# EAGLE design Light (EAGLE 8.7.0)
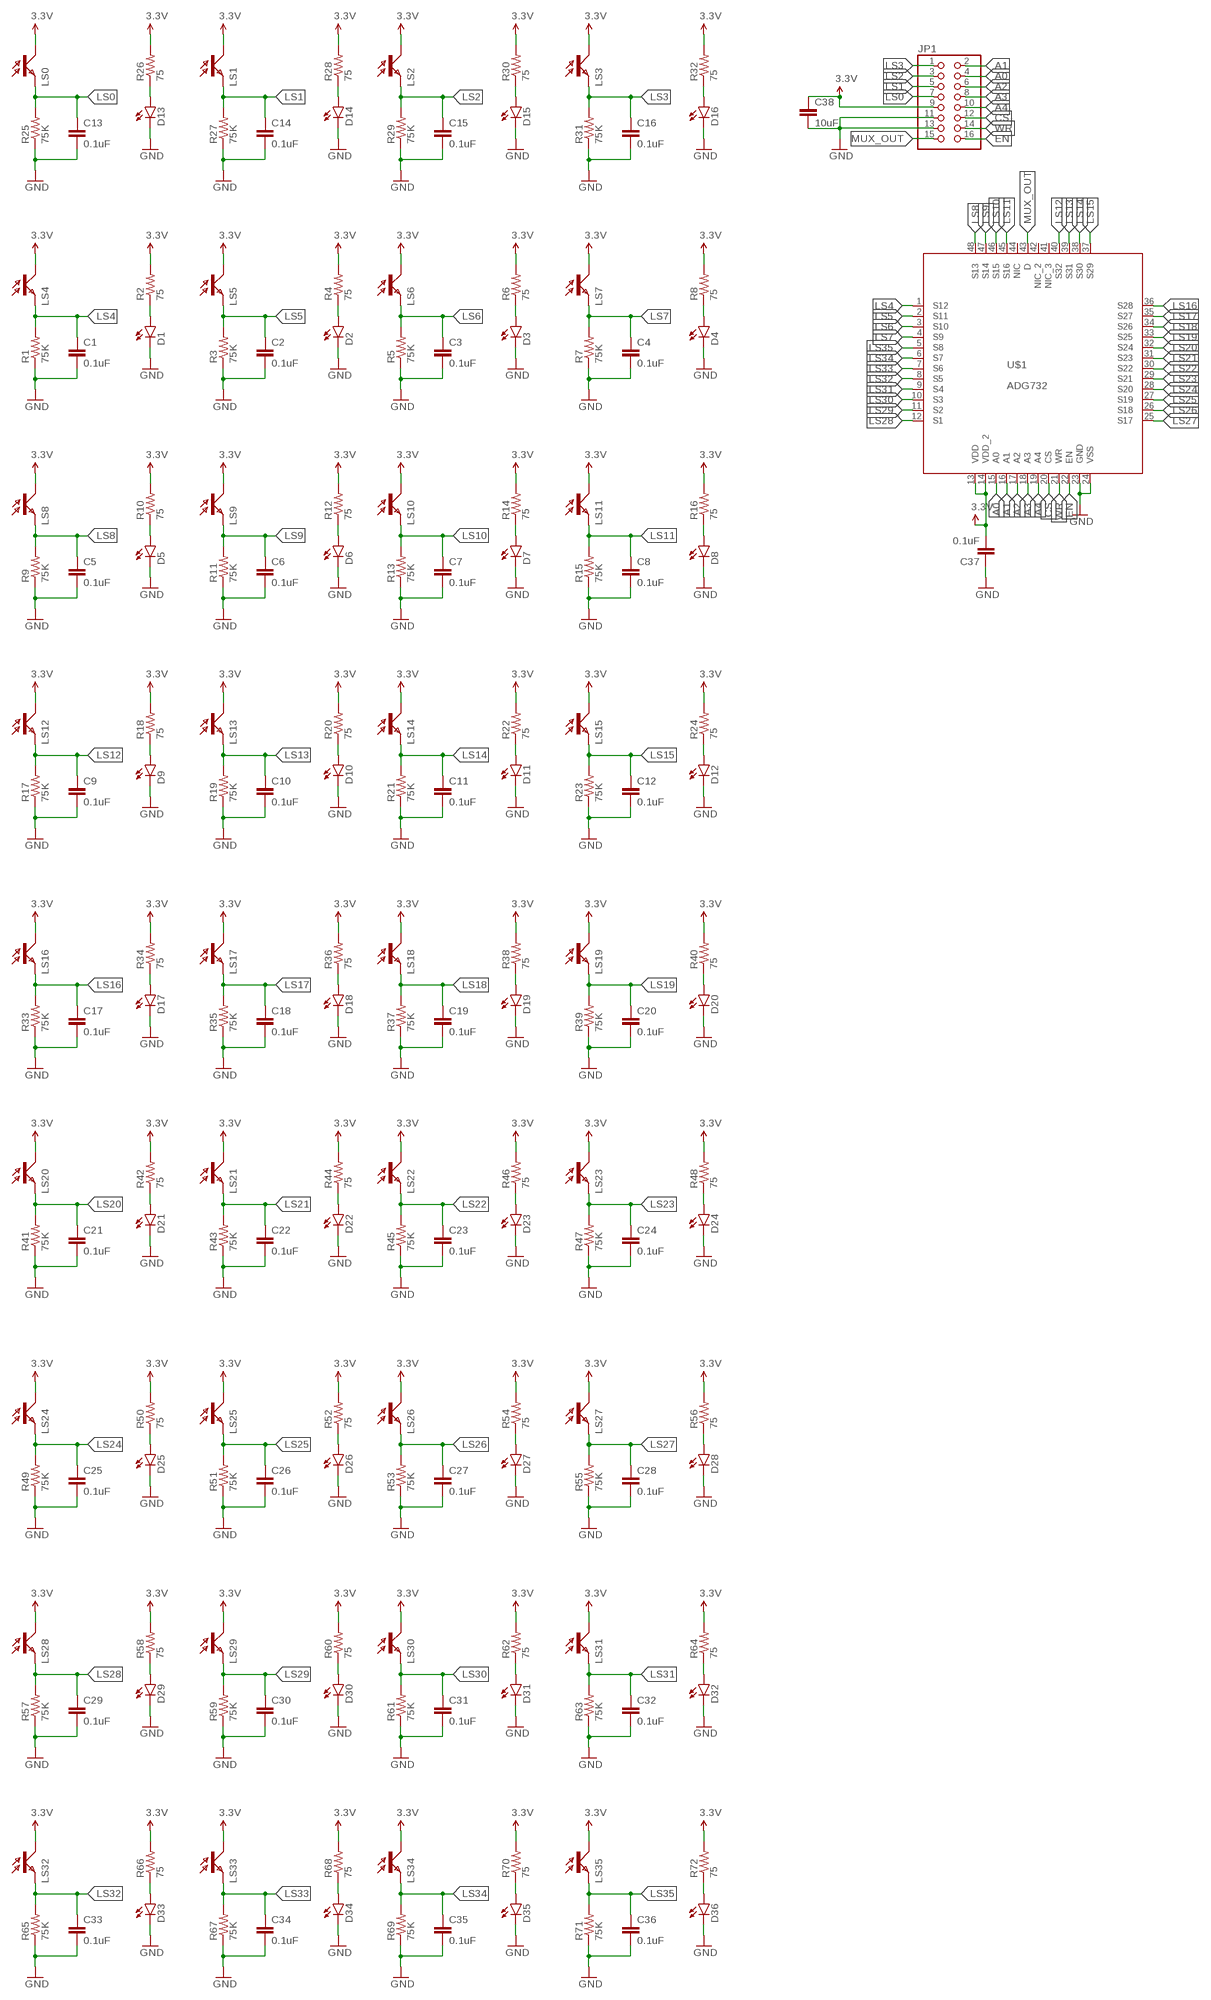
[diagram p0: schematic, sheet 1]

## Parts
C1  0.1uF  CAP0603-CAP  [0603-CAP]
C2  0.1uF  CAP0603-CAP  [0603-CAP]
C3  0.1uF  CAP0603-CAP  [0603-CAP]
C4  0.1uF  CAP0603-CAP  [0603-CAP]
C5  0.1uF  CAP0603-CAP  [0603-CAP]
C6  0.1uF  CAP0603-CAP  [0603-CAP]
C7  0.1uF  CAP0603-CAP  [0603-CAP]
C8  0.1uF  CAP0603-CAP  [0603-CAP]
C9  0.1uF  CAP0603-CAP  [0603-CAP]
C10  0.1uF  CAP0603-CAP  [0603-CAP]
C11  0.1uF  CAP0603-CAP  [0603-CAP]
C12  0.1uF  CAP0603-CAP  [0603-CAP]
C13  0.1uF  CAP0603-CAP  [0603-CAP]
C14  0.1uF  CAP0603-CAP  [0603-CAP]
C15  0.1uF  CAP0603-CAP  [0603-CAP]
C16  0.1uF  CAP0603-CAP  [0603-CAP]
C17  0.1uF  CAP0603-CAP  [0603-CAP]
C18  0.1uF  CAP0603-CAP  [0603-CAP]
C19  0.1uF  CAP0603-CAP  [0603-CAP]
C20  0.1uF  CAP0603-CAP  [0603-CAP]
C21  0.1uF  CAP0603-CAP  [0603-CAP]
C22  0.1uF  CAP0603-CAP  [0603-CAP]
C23  0.1uF  CAP0603-CAP  [0603-CAP]
C24  0.1uF  CAP0603-CAP  [0603-CAP]
C25  0.1uF  CAP0603-CAP  [0603-CAP]
C26  0.1uF  CAP0603-CAP  [0603-CAP]
C27  0.1uF  CAP0603-CAP  [0603-CAP]
C28  0.1uF  CAP0603-CAP  [0603-CAP]
C29  0.1uF  CAP0603-CAP  [0603-CAP]
C30  0.1uF  CAP0603-CAP  [0603-CAP]
C31  0.1uF  CAP0603-CAP  [0603-CAP]
C32  0.1uF  CAP0603-CAP  [0603-CAP]
C33  0.1uF  CAP0603-CAP  [0603-CAP]
C34  0.1uF  CAP0603-CAP  [0603-CAP]
C35  0.1uF  CAP0603-CAP  [0603-CAP]
C36  0.1uF  CAP0603-CAP  [0603-CAP]
C37  0.1uF  CAP0603-CAP  [0603-CAP]
C38  10uF  CAP0805  [0805]
D1  LED0603  [LED-0603]
D2  LED0603  [LED-0603]
D3  LED0603  [LED-0603]
D4  LED0603  [LED-0603]
D5  LED0603  [LED-0603]
D6  LED0603  [LED-0603]
D7  LED0603  [LED-0603]
D8  LED0603  [LED-0603]
D9  LED0603  [LED-0603]
D10  LED0603  [LED-0603]
D11  LED0603  [LED-0603]
D12  LED0603  [LED-0603]
D13  LED0603  [LED-0603]
D14  LED0603  [LED-0603]
D15  LED0603  [LED-0603]
D16  LED0603  [LED-0603]
D17  LED0603  [LED-0603]
D18  LED0603  [LED-0603]
D19  LED0603  [LED-0603]
D20  LED0603  [LED-0603]
D21  LED0603  [LED-0603]
D22  LED0603  [LED-0603]
D23  LED0603  [LED-0603]
D24  LED0603  [LED-0603]
D25  LED0603  [LED-0603]
D26  LED0603  [LED-0603]
D27  LED0603  [LED-0603]
D28  LED0603  [LED-0603]
D29  LED0603  [LED-0603]
D30  LED0603  [LED-0603]
D31  LED0603  [LED-0603]
D32  LED0603  [LED-0603]
D33  LED0603  [LED-0603]
D34  LED0603  [LED-0603]
D35  LED0603  [LED-0603]
D36  LED0603  [LED-0603]
JP1  PINHD-2X8SMT  [2X08_SMT]
LS0  ALS  [SMD]
LS1  ALS  [SMD]
LS2  ALS  [SMD]
LS3  ALS  [SMD]
LS4  ALS  [SMD]
LS5  ALS  [SMD]
LS6  ALS  [SMD]
LS7  ALS  [SMD]
LS8  ALS  [SMD]
LS9  ALS  [SMD]
LS10  ALS  [SMD]
LS11  ALS  [SMD]
LS12  ALS  [SMD]
LS13  ALS  [SMD]
LS14  ALS  [SMD]
LS15  ALS  [SMD]
LS16  ALS  [SMD]
LS17  ALS  [SMD]
LS18  ALS  [SMD]
LS19  ALS  [SMD]
LS20  ALS  [SMD]
LS21  ALS  [SMD]
LS22  ALS  [SMD]
LS23  ALS  [SMD]
LS24  ALS  [SMD]
LS25  ALS  [SMD]
LS26  ALS  [SMD]
LS27  ALS  [SMD]
LS28  ALS  [SMD]
LS29  ALS  [SMD]
LS30  ALS  [SMD]
LS31  ALS  [SMD]
LS32  ALS  [SMD]
LS33  ALS  [SMD]
LS34  ALS  [SMD]
LS35  ALS  [SMD]
R1  75K  RESISTOR0603  [0603-RES]
R2  75  RESISTOR0603  [0603-RES]
R3  75K  RESISTOR0603  [0603-RES]
R4  75  RESISTOR0603  [0603-RES]
R5  75K  RESISTOR0603  [0603-RES]
R6  75  RESISTOR0603  [0603-RES]
R7  75K  RESISTOR0603  [0603-RES]
R8  75  RESISTOR0603  [0603-RES]
R9  75K  RESISTOR0603  [0603-RES]
R10  75  RESISTOR0603  [0603-RES]
R11  75K  RESISTOR0603  [0603-RES]
R12  75  RESISTOR0603  [0603-RES]
R13  75K  RESISTOR0603  [0603-RES]
R14  75  RESISTOR0603  [0603-RES]
R15  75K  RESISTOR0603  [0603-RES]
R16  75  RESISTOR0603  [0603-RES]
R17  75K  RESISTOR0603  [0603-RES]
R18  75  RESISTOR0603  [0603-RES]
R19  75K  RESISTOR0603  [0603-RES]
R20  75  RESISTOR0603  [0603-RES]
R21  75K  RESISTOR0603  [0603-RES]
R22  75  RESISTOR0603  [0603-RES]
R23  75K  RESISTOR0603  [0603-RES]
R24  75  RESISTOR0603  [0603-RES]
R25  75K  RESISTOR0603  [0603-RES]
R26  75  RESISTOR0603  [0603-RES]
R27  75K  RESISTOR0603  [0603-RES]
R28  75  RESISTOR0603  [0603-RES]
R29  75K  RESISTOR0603  [0603-RES]
R30  75  RESISTOR0603  [0603-RES]
R31  75K  RESISTOR0603  [0603-RES]
R32  75  RESISTOR0603  [0603-RES]
R33  75K  RESISTOR0603  [0603-RES]
R34  75  RESISTOR0603  [0603-RES]
R35  75K  RESISTOR0603  [0603-RES]
R36  75  RESISTOR0603  [0603-RES]
R37  75K  RESISTOR0603  [0603-RES]
R38  75  RESISTOR0603  [0603-RES]
R39  75K  RESISTOR0603  [0603-RES]
R40  75  RESISTOR0603  [0603-RES]
R41  75K  RESISTOR0603  [0603-RES]
R42  75  RESISTOR0603  [0603-RES]
R43  75K  RESISTOR0603  [0603-RES]
R44  75  RESISTOR0603  [0603-RES]
R45  75K  RESISTOR0603  [0603-RES]
R46  75  RESISTOR0603  [0603-RES]
R47  75K  RESISTOR0603  [0603-RES]
R48  75  RESISTOR0603  [0603-RES]
R49  75K  RESISTOR0603  [0603-RES]
R50  75  RESISTOR0603  [0603-RES]
R51  75K  RESISTOR0603  [0603-RES]
R52  75  RESISTOR0603  [0603-RES]
R53  75K  RESISTOR0603  [0603-RES]
R54  75  RESISTOR0603  [0603-RES]
R55  75K  RESISTOR0603  [0603-RES]
R56  75  RESISTOR0603  [0603-RES]
R57  75K  RESISTOR0603  [0603-RES]
R58  75  RESISTOR0603  [0603-RES]
R59  75K  RESISTOR0603  [0603-RES]
R60  75  RESISTOR0603  [0603-RES]
R61  75K  RESISTOR0603  [0603-RES]
R62  75  RESISTOR0603  [0603-RES]
R63  75K  RESISTOR0603  [0603-RES]
R64  75  RESISTOR0603  [0603-RES]
R65  75K  RESISTOR0603  [0603-RES]
R66  75  RESISTOR0603  [0603-RES]
R67  75K  RESISTOR0603  [0603-RES]
R68  75  RESISTOR0603  [0603-RES]
R69  75K  RESISTOR0603  [0603-RES]
R70  75  RESISTOR0603  [0603-RES]
R71  75K  RESISTOR0603  [0603-RES]
R72  75  RESISTOR0603  [0603-RES]
U$1  ADG732  [QFP-7X7-48-NO-EXP]

## Nets
3.3V: C37.2 C38.1 JP1.9 LS0.C LS1.C LS2.C LS3.C LS4.C LS5.C LS6.C LS7.C LS8.C LS9.C LS10.C LS11.C LS12.C LS13.C LS14.C LS15.C LS16.C LS17.C LS18.C LS19.C LS20.C LS21.C LS22.C LS23.C LS24.C LS25.C LS26.C LS27.C LS28.C LS29.C LS30.C LS31.C LS32.C LS33.C LS34.C LS35.C R2.2 R4.2 R6.2 R8.2 R10.2 R12.2 R14.2 R16.2 R18.2 R20.2 R22.2 R24.2 R26.2 R28.2 R30.2 R32.2 R34.2 R36.2 R38.2 R40.2 R42.2 R44.2 R46.2 R48.2 R50.2 R52.2 R54.2 R56.2 R58.2 R60.2 R62.2 R64.2 R66.2 R68.2 R70.2 R72.2 U$1.13(VDD) U$1.14(VDD_2)
A0: JP1.4 U$1.15(A0)
A1: JP1.2 U$1.16(A1)
A2: JP1.6 U$1.17(A2)
A3: JP1.8 U$1.18(A3)
A4: JP1.10 U$1.19(A4)
CS: JP1.12 U$1.20(CS)
EN: JP1.16 U$1.22(EN)
GND: C1.2 C2.2 C3.2 C4.2 C5.2 C6.2 C7.2 C8.2 C9.2 C10.2 C11.2 C12.2 C13.2 C14.2 C15.2 C16.2 C17.2 C18.2 C19.2 C20.2 C21.2 C22.2 C23.2 C24.2 C25.2 C26.2 C27.2 C28.2 C29.2 C30.2 C31.2 C32.2 C33.2 C34.2 C35.2 C36.2 C37.1 C38.2 D1.C D2.C D3.C D4.C D5.C D6.C D7.C D8.C D9.C D10.C D11.C D12.C D13.C D14.C D15.C D16.C D17.C D18.C D19.C D20.C D21.C D22.C D23.C D24.C D25.C D26.C D27.C D28.C D29.C D30.C D31.C D32.C D33.C D34.C D35.C D36.C JP1.11 JP1.13 R1.1 R3.1 R5.1 R7.1 R9.1 R11.1 R13.1 R15.1 R17.1 R19.1 R21.1 R23.1 R25.1 R27.1 R29.1 R31.1 R33.1 R35.1 R37.1 R39.1 R41.1 R43.1 R45.1 R47.1 R49.1 R51.1 R53.1 R55.1 R57.1 R59.1 R61.1 R63.1 R65.1 R67.1 R69.1 R71.1 U$1.23(GND) U$1.24(VSS)
LS0: C13.1 JP1.7 LS0.E R25.2
LS1: C14.1 JP1.5 LS1.E R27.2
LS2: C15.1 JP1.3 LS2.E R29.2
LS3: C16.1 JP1.1 LS3.E R31.2
LS4: C1.1 LS4.E R1.2 U$1.1(S12)
LS5: C2.1 LS5.E R3.2 U$1.2(S11)
LS6: C3.1 LS6.E R5.2 U$1.3(S10)
LS7: C4.1 LS7.E R7.2 U$1.4(S9)
LS8: C5.1 LS8.E R9.2 U$1.48(S13)
LS9: C6.1 LS9.E R11.2 U$1.47(S14)
LS10: C7.1 LS10.E R13.2 U$1.46(S15)
LS11: C8.1 LS11.E R15.2 U$1.45(S16)
LS12: C9.1 LS12.E R17.2 U$1.40(S32)
LS13: C10.1 LS13.E R19.2 U$1.39(S31)
LS14: C11.1 LS14.E R21.2 U$1.38(S30)
LS15: C12.1 LS15.E R23.2 U$1.37(S29)
LS16: C17.1 LS16.E R33.2 U$1.36(S28)
LS17: C18.1 LS17.E R35.2 U$1.35(S27)
LS18: C19.1 LS18.E R37.2 U$1.34(S26)
LS19: C20.1 LS19.E R39.2 U$1.33(S25)
LS20: C21.1 LS20.E R41.2 U$1.32(S24)
LS21: C22.1 LS21.E R43.2 U$1.31(S23)
LS22: C23.1 LS22.E R45.2 U$1.30(S22)
LS23: C24.1 LS23.E R47.2 U$1.29(S21)
LS24: C25.1 LS24.E R49.2 U$1.28(S20)
LS25: C26.1 LS25.E R51.2 U$1.27(S19)
LS26: C27.1 LS26.E R53.2 U$1.26(S18)
LS27: C28.1 LS27.E R55.2 U$1.25(S17)
LS28: C29.1 LS28.E R57.2 U$1.12(S1)
LS29: C30.1 LS29.E R59.2 U$1.11(S2)
LS30: C31.1 LS30.E R61.2 U$1.10(S3)
LS31: C32.1 LS31.E R63.2 U$1.9(S4)
LS32: C33.1 LS32.E R65.2 U$1.8(S5)
LS33: C34.1 LS33.E R67.2 U$1.7(S6)
LS34: C35.1 LS34.E R69.2 U$1.6(S7)
LS35: C36.1 LS35.E R71.2 U$1.5(S8)
MUX_OUT: JP1.15 U$1.43(D)
N$1: D2.A R4.1
N$2: D1.A R2.1
N$3: D3.A R6.1
N$4: D4.A R8.1
N$5: D5.A R10.1
N$6: D6.A R12.1
N$7: D7.A R14.1
N$8: D8.A R16.1
N$9: D9.A R18.1
N$10: D10.A R20.1
N$11: D11.A R22.1
N$12: D12.A R24.1
N$13: D13.A R26.1
N$14: D14.A R28.1
N$15: D15.A R30.1
N$16: D16.A R32.1
N$17: D17.A R34.1
N$18: D18.A R36.1
N$19: D19.A R38.1
N$20: D20.A R40.1
N$21: D21.A R42.1
N$22: D22.A R44.1
N$23: D23.A R46.1
N$24: D24.A R48.1
N$25: D25.A R50.1
N$26: D26.A R52.1
N$27: D27.A R54.1
N$28: D28.A R56.1
N$29: D29.A R58.1
N$30: D30.A R60.1
N$31: D31.A R62.1
N$32: D32.A R64.1
N$33: D33.A R66.1
N$34: D34.A R68.1
N$35: D35.A R70.1
N$36: D36.A R72.1
WR: JP1.14 U$1.21(WR)
Unconnected: U$1.41(NIC_3) U$1.42(NIC_2) U$1.44(NIC)

## Library data of the parts
C1-C38 = SparkFun-Capacitors:CAP: Capacitor Standard 0603 ceramic capacitor, and 0.1" leaded capacitor.
D1-D36 = SparkFun-LED:LED: LEDs Standard schematic elements and footprints for 5mm, 3mm, 1206, and 0603 sized LEDs. 5mm - Spark Fun Electronics SKU : COM-00529 (and others)
JP1 = pinhead+:PINHD-2X8: PIN HEADER
LS0 LS1-LS35 = phototransitor-ALS-PT19-315CL177TR8:ALS
R1-R72 = SparkFun-Resistors:RESISTOR: Resistor Basic schematic elements and footprints for 0603, 1206, and PTH resistors.
U$1 = analog-devices:ADG732

## Board
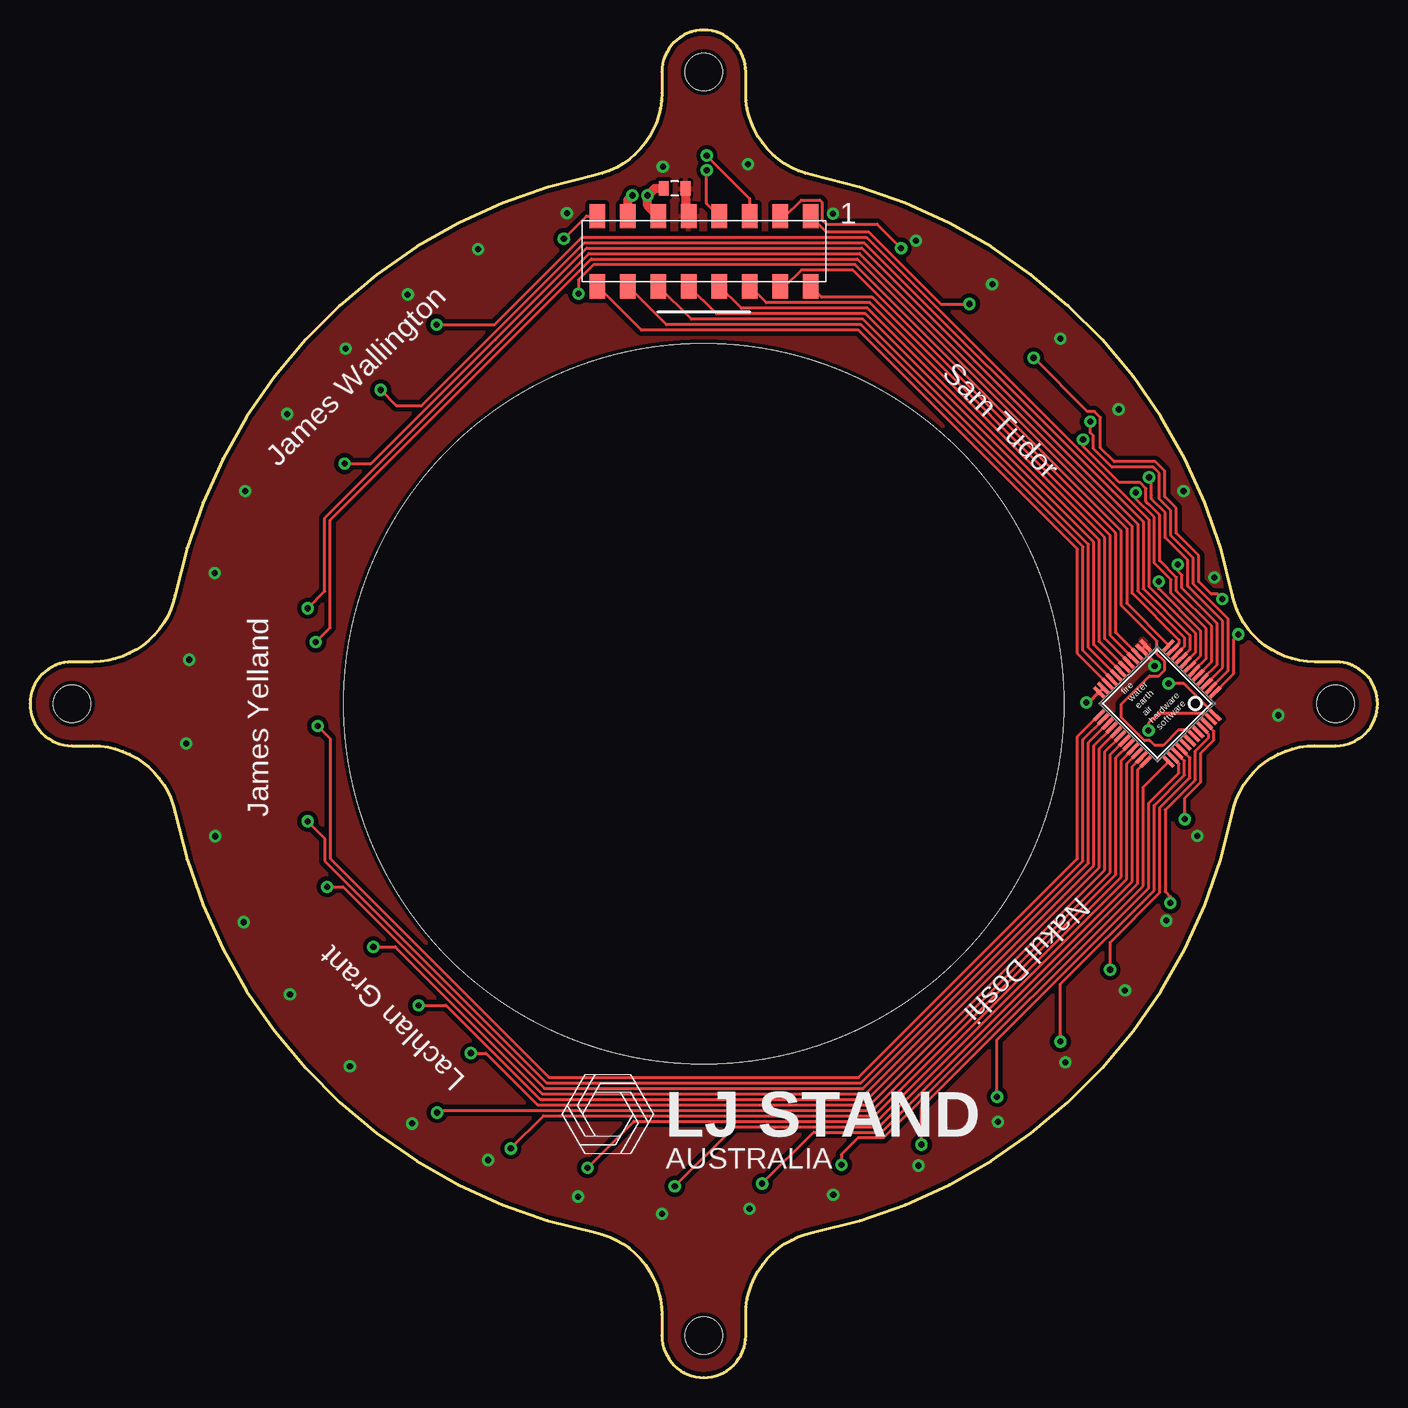
[diagram p1: board, top side]
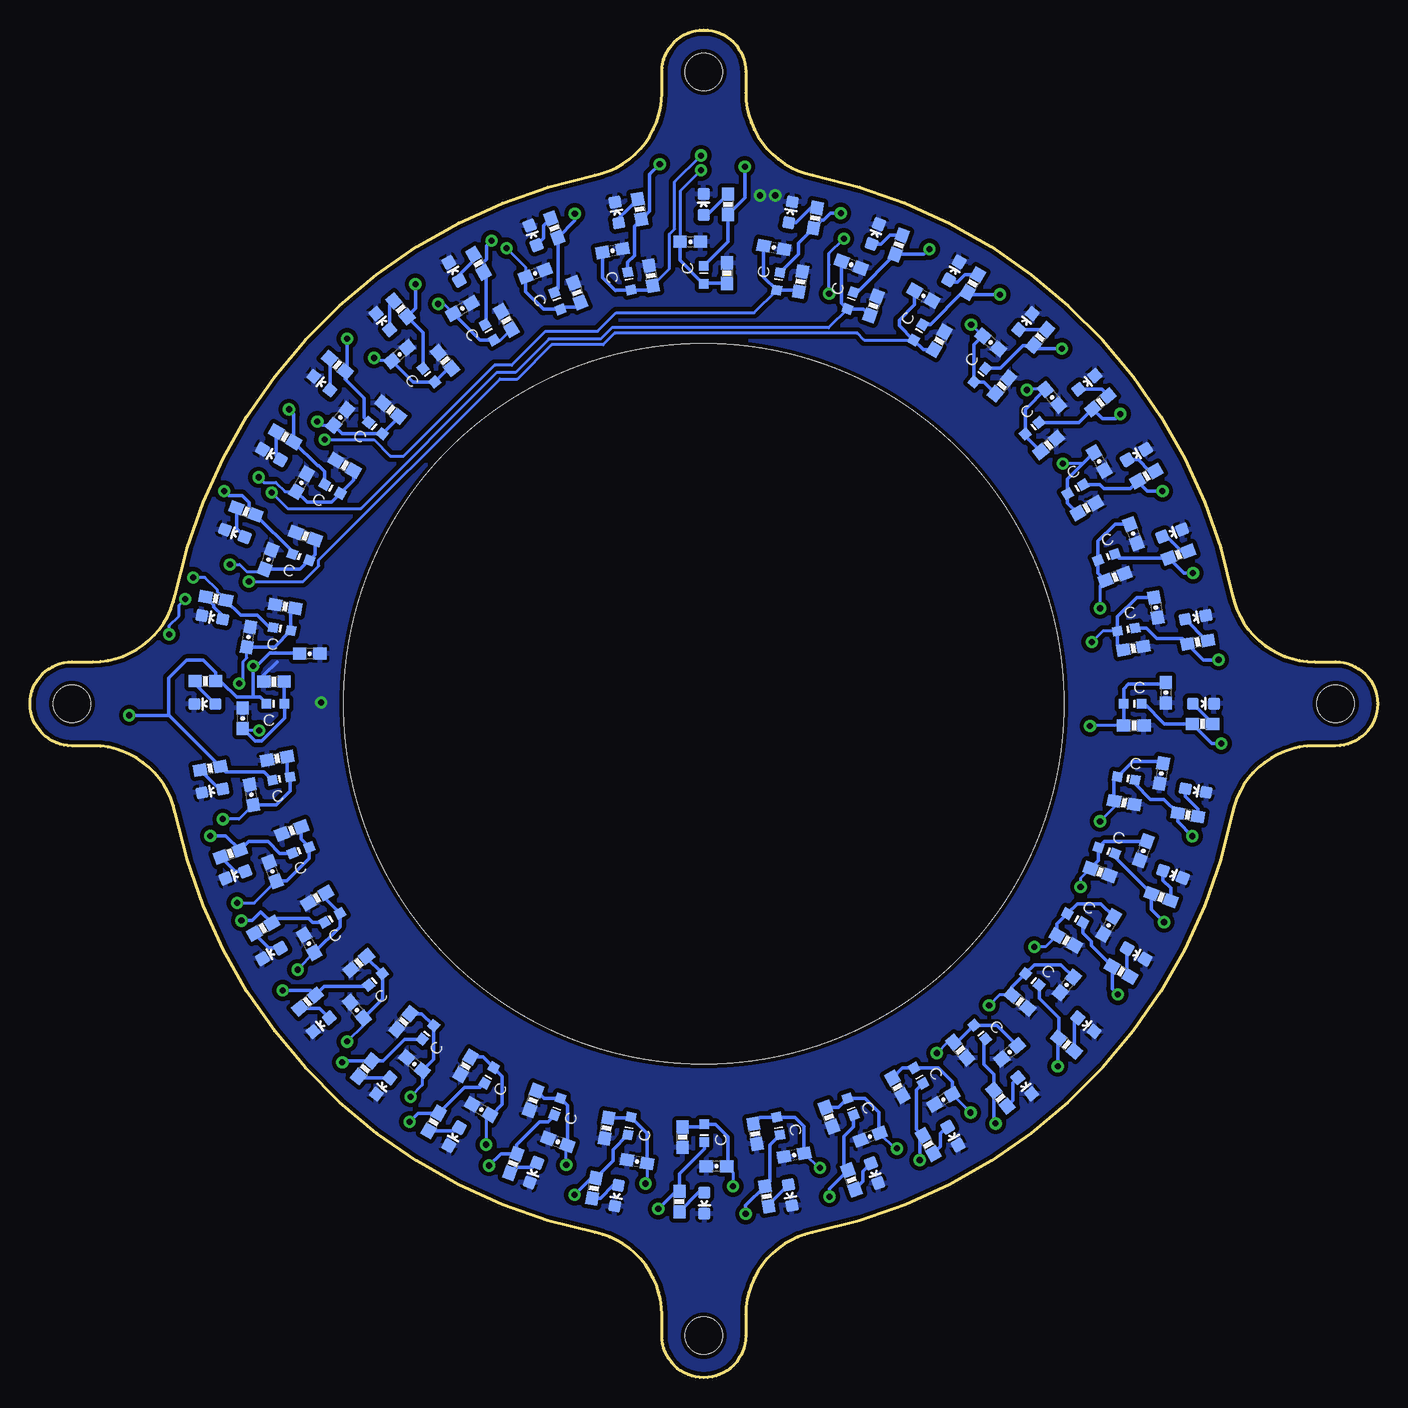
[diagram p2: board, bottom side, seen from below]

Size 112.34 x 112.34 mm. Coordinates in mm from the lower left corner, seen from the top.
Outline: 108.84,52.67 arc180 108.84,59.67 107.1,59.67 arc-78 100.25,65.26 arc67 65.26,100.25 arc-78 59.67,107.1 59.67,108.84 arc180 52.67,108.84 52.67,107.1 arc-78 47.09,100.25 arc67 12.1,65.26 arc-78 5.24,59.67 3.5,59.67 arc180 3.5,52.67 5.24,52.67 arc-78 12.1,47.09 arc67 47.09,12.1 arc-78 52.67,5.24 52.67,3.5 arc180 59.67,3.5 59.67,5.24 arc-78 65.26,12.1 arc67 100.25,47.09 arc-78 107.1,52.67 108.84,52.67
Copper layers (1*16): Top 0.035mm / dielectric 1.5mm / Bottom 0.035mm
Design rules "SparkFun": minimum track width 8mil, minimum drill 20mil, track to track 8mil, track to pad 8mil, pad to pad 8mil, via to via 8mil, smd to smd 8mil, copper to edge 10mil, drill to drill 8mil, minimum pad ring 12mil, minimum via ring 10mil, stop-mask expansion 4mil, vias tented up to drill 25mil, thermal gap 10mil
Holes 3.1 mm at 3.5,56.17 108.84,56.17 56.17,108.84 56.17,3.5
Holes 60 mm at 56.17,56.17

### Footprints (pad centres in the part's own frame; a part is rotated, then mirrored left to right if it is on the bottom)
0603-CAP = smd 1.1 x 1: 1 -0.85,0; 2 0.85,0
0805 = smd 0.8 x 1.2: 1 -0.9,0; 2 0.9,0
LED-0603 = smd 1 x 1: A 0,-0.877; C 0,0.877
2X08_SMT = smd 1.27 x 2.032: 1 -8.89,-2.921; 2 -8.89,2.921; 3 -6.35,-2.921; 4 -6.35,2.921; 5 -3.81,-2.921; 6 -3.81,2.921; 7 -1.27,-2.921; 8 -1.27,2.921; 9 1.27,-2.921; 10 1.27,2.921; 11 3.81,-2.921; 12 3.81,2.921; 13 6.35,-2.921; 14 6.35,2.921; 15 8.89,-2.921; 16 8.89,2.921
SMD = smd 0.8 x 0.8: C -0.75,0; E 0.75,0
0603-RES = smd 1.1 x 1: 1 -0.85,0; 2 0.85,0
QFP-7X7-48-NO-EXP = smd 0.3 x 1.2: 1 -2.75,-4.1; 2 -2.25,-4.1; 3 -1.75,-4.1; 4 -1.25,-4.1; 5 -0.75,-4.1; 6 -0.25,-4.1; 7 0.25,-4.1; 8 0.75,-4.1; 9 1.25,-4.1; 10 1.75,-4.1; 11 2.25,-4.1; 12 2.75,-4.1; 25 2.75,4.1; 26 2.25,4.1; 27 1.75,4.1; 28 1.25,4.1; 29 0.75,4.1; 30 0.25,4.1; 31 -0.25,4.1; 32 -0.75,4.1; 33 -1.25,4.1; 34 -1.75,4.1; 35 -2.25,4.1; 36 -2.75,4.1 | smd 1.2 x 0.3: 13 4.1,-2.75; 14 4.1,-2.25; 15 4.1,-1.75; 16 4.1,-1.25; 17 4.1,-0.75; 18 4.1,-0.25; 19 4.1,0.25; 20 4.1,0.75; 21 4.1,1.25; 22 4.1,1.75; 23 4.1,2.25; 24 4.1,2.75; 37 -4.1,2.75; 38 -4.1,2.25; 39 -4.1,1.75; 40 -4.1,1.25; 41 -4.1,0.75; 42 -4.1,0.25; 43 -4.1,-0.25; 44 -4.1,-0.75; 45 -4.1,-1.25; 46 -4.1,-1.75; 47 -4.1,-2.25; 48 -4.1,-2.75

### Placement (x,y rotation side)
C1  81.53,85.32 40 bottom
C2  86.49,80.03 50 bottom
C3  89.71,74.6 60 bottom
C4  92.48,68.2 70 bottom
C5  94.13,61.75 80 bottom
C6  94.61,54.97 90 bottom
C7  93.88,48.59 100 bottom
C8  92.13,42.19 110 bottom
C9  89.08,36.17 120 bottom
C10  85.09,30.63 130 bottom
C11  80.29,26.14 140 bottom
C12  74.73,22.35 150 bottom
C13  57.3,94.69 0 bottom
C14  63.77,93.95 10 bottom
C15  70.23,92.05 20 bottom
C16  76.3,89.13 30 bottom
C17  68.35,19.66 160 bottom
C18  61.75,18.01 170 bottom
C19  55.12,17.63 180 bottom
C20  48.64,18.57 190 bottom
C21  42.32,20.09 200 bottom
C22  36.2,23.19 210 bottom
C23  30.68,27.13 220 bottom
C24  25.91,32.74 230 bottom
C25  22.43,37.69 240 bottom
C26  19.53,43.92 250 bottom
C27  18.03,50.37 260 bottom
C28  17.65,57.1 270 bottom
C29  18.49,64.21 280 bottom
C30  20.37,70.36 290 bottom
C31  23.22,76.38 300 bottom
C32  27.15,81.74 310 bottom
C33  32.26,86.31 320 bottom
C34  37.87,90.19 330 bottom
C35  43.89,92.79 340 bottom
C36  50.34,94.21 350 bottom
C37  89.03,60.35 180 bottom
C38  53.75,99.14 180 top
D1  56.19,97.79 0 bottom
D2  63.42,97.13 10 bottom
D3  70.41,95.22 20 bottom
D4  76.99,92.23 30 bottom
D5  82.93,88.04 40 bottom
D6  88.01,82.91 50 bottom
D7  92.23,76.94 60 bottom
D8  95.28,70.38 70 bottom
D9  97.16,63.37 80 bottom
D10  97.77,56.16 90 bottom
D11  97.16,48.92 100 bottom
D12  95.22,41.91 110 bottom
D13  92.23,35.38 120 bottom
D14  88.06,29.41 130 bottom
D15  82.91,24.31 140 bottom
D16  76.99,20.09 150 bottom
D17  70.38,17.09 160 bottom
D18  63.45,15.16 170 bottom
D19  56.13,14.55 180 bottom
D20  48.97,15.21 190 bottom
D21  41.94,17.04 200 bottom
D22  35.41,20.14 210 bottom
D23  29.41,24.33 220 bottom
D24  24.31,29.44 230 bottom
D25  20.14,35.33 240 bottom
D26  17.07,41.96 250 bottom
D27  15.16,48.95 260 bottom
D28  14.53,56.19 270 bottom
D29  15.19,63.37 280 bottom
D30  17.12,70.41 290 bottom
D31  20.12,76.96 300 bottom
D32  24.26,82.96 310 bottom
D33  29.36,88.04 320 bottom
D34  35.33,92.25 330 bottom
D35  41.88,95.33 340 bottom
D36  48.95,97.16 350 bottom
JP1  56.18,93.9 180 top
LS0  56.19,91.92 270 bottom
LS1  62.38,91.42 280 bottom
LS2  68.38,89.76 290 bottom
LS3  74.04,87.15 300 bottom
LS4  79.1,83.57 310 bottom
LS5  83.54,79.17 320 bottom
LS6  87.12,74.09 330 bottom
LS7  89.76,68.4 340 bottom
LS8  91.34,62.41 350 bottom
LS9  91.87,56.19 0 bottom
LS10  91.39,49.94 10 bottom
LS11  89.76,43.97 20 bottom
LS12  87.15,38.33 30 bottom
LS13  83.54,33.2 40 bottom
LS14  79.17,28.78 50 bottom
LS15  74.07,25.2 60 bottom
LS16  68.38,22.58 70 bottom
LS17  62.38,20.98 80 bottom
LS18  56.13,20.37 90 bottom
LS19  49.96,20.98 100 bottom
LS20  43.94,22.58 110 bottom
LS21  38.28,25.17 120 bottom
LS22  33.17,28.8 130 bottom
LS23  28.78,33.2 140 bottom
LS24  25.22,38.3 150 bottom
LS25  22.58,43.94 160 bottom
LS26  20.95,49.96 170 bottom
LS27  20.42,56.19 180 bottom
LS28  20.95,62.36 190 bottom
LS29  22.61,68.4 200 bottom
LS30  25.2,74.07 210 bottom
LS31  28.8,79.15 220 bottom
LS32  33.17,83.57 230 bottom
LS33  38.3,87.15 240 bottom
LS34  43.94,89.79 250 bottom
LS35  49.96,91.39 260 bottom
R1  77.75,84.78 310 bottom
R2  54.15,97.81 270 bottom
R3  82.27,80.7 320 bottom
R4  61.53,97.39 280 bottom
R5  86.11,76.05 330 bottom
R6  68.63,95.83 290 bottom
R7  89.38,70.16 340 bottom
R8  74.95,92.89 300 bottom
R9  91.08,64.29 350 bottom
R10  81.46,89.1 310 bottom
R11  92,58.01 0 bottom
R12  86.72,84.43 320 bottom
R13  91.75,51.61 10 bottom
R14  91.08,78.44 330 bottom
R15  90.53,45.62 20 bottom
R16  94.34,72.21 340 bottom
R17  88.42,39.98 30 bottom
R18  96.85,64.95 350 bottom
R19  84.94,34.57 40 bottom
R20  97.71,58.06 0 bottom
R21  81.2,29.69 50 bottom
R22  97.31,50.8 10 bottom
R23  76.02,25.98 60 bottom
R24  95.63,43.69 20 bottom
R25  54.23,92.08 270 bottom
R26  92.91,37.47 30 bottom
R27  60.58,91.87 280 bottom
R28  89.2,31.34 40 bottom
R29  66.75,90.45 290 bottom
R30  84.4,25.76 50 bottom
R31  72.64,88.14 300 bottom
R32  78.69,21.31 60 bottom
R33  70.41,23.11 70 bottom
R34  72.06,17.86 70 bottom
R35  64.29,20.8 80 bottom
R36  65.33,15.8 80 bottom
R37  57.96,20.04 90 bottom
R38  58.22,14.68 90 bottom
R39  51.89,20.32 100 bottom
R40  50.93,15.11 100 bottom
R41  45.74,21.72 110 bottom
R42  43.87,16.48 110 bottom
R43  40.03,24.23 120 bottom
R44  37.47,19.43 120 bottom
R45  34.8,27.3 130 bottom
R46  31.45,23.29 130 bottom
R47  29.82,31.34 140 bottom
R48  25.93,27.76 140 bottom
R49  25.98,36.45 150 bottom
R50  21.39,33.86 150 bottom
R51  23.14,42.16 160 bottom
R52  18.06,40.06 160 bottom
R53  21.13,47.93 170 bottom
R54  15.82,46.91 170 bottom
R55  20.32,54.36 180 bottom
R56  14.61,54.51 180 bottom
R57  20.37,60.81 190 bottom
R58  15.01,61.32 190 bottom
R59  21.89,66.75 200 bottom
R60  16.61,68.61 200 bottom
R61  24.26,72.49 210 bottom
R62  19.28,75.16 210 bottom
R63  27.43,77.75 220 bottom
R64  23.11,81.31 220 bottom
R65  31.32,82.68 230 bottom
R66  28.14,86.72 230 bottom
R67  36.55,86.44 240 bottom
R68  33.76,91.21 240 bottom
R69  42.04,89.36 250 bottom
R70  39.93,94.44 250 bottom
R71  48.11,91.36 260 bottom
R72  46.89,96.67 260 bottom
U$1  93.96,56.19 135 top

### Tracks (layer width: path | path; a pad name or v marks a point on that pad's centre or on a via)
3.3V  (via drill 0.51)
  Top 0.254: U$1.13
  Top 0.305: U$1.13 U$1.14 93.75,59.58 v93.75,59.33
  Top 0.762: C38.1 54.65,97.09 JP1.9
  Bottom 0.254: R18.2 96.71,65.5 96.71,65.64 97.77,66.7 v98.73,66.7
  Bottom 0.305: LS0.C 54.15,94.7 R2.2 52.76,98.36 v52.76,100.94 | LS2.C 68.33,90.78 68.33,95.02 R6.2 66.93,96.45 v66.93,97.03 | R12.2 86.06,83.25 | LS5.C 84.48,80.02 84.48,81.66 86.06,83.25 | LS6.C 87.77,75.53 88.27,76.02 88.36,76.02 R14.2 90.35,80.31 v90.75,80.72 | LS7.C 90.47,68.85 R16.2 | 92.86,56.19 LS9.C 93.16,56.72 93.73,56.72 | LS10.C 92.82,50.49 96.02,50.49 R22.2 100.74,55.22 | LS11.C 91.54,43.71 92.51,44.68 94.13,44.68 R24.2 96.02,45.16 v97.31,45.16 | LS13.C 84.22,32.61 87.83,32.61 R28.2 88.95,32.28 v91.29,32.28 | LS14.C 81.12,28.2 82.92,26.41 R30.2 86.19,26.41 v86.31,26.29 | LS15.C 74.81,24.18 76.13,24.18 R32.2 79.98,22.05 v80.7,21.34 | LS16.C 69.17,21.34 69.85,21.34 71.77,19.42 R34.2 73.09,18.66 v74.07,17.68 | LS17.C 63.75,19 63.75,18.06 R36.2 65.56,16.64 v66.95,15.24 | LS18.C 56.13,19.07 58.22,16.99 R38.2 58.51,15.53 v59.97,14.07 | LS19.C 50.67,19.4 50.67,16.35 R40.2 52.68,14.35 v52.68,13.66 | LS21.C 38.43,23.99 38.43,20.71 R44.2 38.18,19.88 v38.18,18.14 | LS20.C 43.69,20.91 44.48,20.12 44.48,17.6 R42.2 45.7,15.75 v45.7,15.09 | LS22.C 32.82,28.1 32.82,26.11 31.99,25.29 R46.2 31.99,21.32 v31.85,21.18 | LS23.C 28.2,31.61 26.59,29.99 R48.2 26.67,28.22 v26.67,25.96 | LS24.C 24.57,37.07 23.88,36.37 23.88,36.04 R50.2 22.12,32.41 v21.67,31.95 | LS25.C 21.88,43.37 R52.2 18.86,39.02 v17.8,37.97 | LS26.C 20.22,49.48 18.95,48.21 17.81,48.21 R54.2 16.66,46.35 v15.44,45.14 | LS27.C 19.46,56.19 17.78,54.51 R56.2 13.8,52.86 v13.03,52.86 | LS28.C 19.28,62.49 18.39,61.59 16.27,61.59 R58.2 14.52,59.84 v13.26,59.84 | LS29.C 21.56,68.31 19.2,68.31 R60.2 16.18,67.08 v15.39,67.08
  Bottom 0.305: LS30.C 23.16,74.44 22.84,74.12 20.63,74.12 R62.2 19.2,73.91 v17.93,73.91 | LS31.C 24.9,79.63 R64.2 22.97,79.96 21.82,79.96 v21.44,80.34 | LS33.C 37.3,87.8 34.62,90.47 R68.2 34,90.3 v31.5,90.3 | LS34.C 43.36,90.49 R70.2 37.81,93.64 v37.36,94.08 | LS35.C 49.81,92.13 48.28,93.65 48.28,94.59 R72.2 46.37,96.5 46.19,96.5 45.61,97.08 v44.76,97.08 | R66.2 28.66,86.04 | 28.66,86.04 28.4,85.78 v26.31,85.78 | 100.74,55.22 v104.06,55.22 | 100.74,55.22 100.76,55.24 100.76,58.34 99.29,59.82 97.89,59.82 96.86,58.79 R20.2 96.76,57.96 96.36,57.96 95.12,56.72 93.73,56.72 | 86.06,83.25 85.9,83.41 v85.9,86.61 | v80.21,91.16 80.21,89.15 R10.2 79.58,87.12 LS4.C | LS12.C 88.78,37.95 89.1,38.28 91.79,38.28 R26.2 93.1,38.81 93.81,38.1 v94.72,38.1 | LS3.C 74.32,87.89 74.32,91.94 R8.2 74.53,93 74.29,93.24 74.29,94.37 v73.86,94.79 | LS1.C 62.51,92.97 61.93,93.55 61.93,96.01 R4.2 60.71,97.24 60.71,100.31 v59.84,101.17 | LS32.C 31.45,84.14 29.55,86.04 28.66,86.04 | R16.2 93.78,72.16 | R16.2 94.06,72.45 94.06,72.94 94.66,73.55 95.8,73.55 v96.16,73.91 | 93.73,56.72 93.75,56.75 93.75,58.66 v93.75,59.33 93.45,59.33 92.38,60.4 92.13,60.4 89.93,60.4 C37.2 | R18.2 94.8,63.59 93.41,63.59 92.36,62.54 LS8.C
  pour Top (isolate 0.356): -16.18,117.91 124.03,117.91 124.03,-6.27 -16.71,-6.27 -16.71,70.33 -16.46,70.33 -16.46,88.62
A0
  Top 0.254: U$1.15 90.52,62.1 90.52,70.4 68.58,92.33 64.3,92.33 62.96,90.98 JP1.4
A1
  Top 0.254: U$1.16 91.94,60 90.06,61.88 90.06,66.32 90.06,70.21 70.21,90.06 66,90.06 JP1.2
A2
  Top 0.254: U$1.17 89.6,61.6 89.6,70.02 70.02,89.6 61.38,89.6 JP1.6
A3
  Top 0.254: JP1.8 59.29,89.14 69.83,89.14 89.14,69.83 89.14,61.35 U$1.18
A4
  Top 0.254: JP1.10 57.21,88.69 69.64,88.69 88.69,69.64 88.69,61.1 U$1.19
CS
  Top 0.254: JP1.12 55.13,88.23 69.45,88.23 88.23,69.45 88.23,60.85 U$1.20
EN
  Top 0.254: JP1.16 50.96,87.31 69.07,87.31 87.31,69.07 87.31,60.35 U$1.22
GND  (via drill 0.51)
  Top 0.305: U$1.23 | U$1.23 U$1.24 88.26,56.29 v88.06,56.29
  Top 0.762: JP1.11 51.49,97.71 v51.49,98.55 52.07,99.14 C38.2 | JP1.13 49.84,98.17 v50.22,98.55
  Bottom 0.305: R11.1 92.85,58.56 91.75,59.66
  pour Bottom (isolate 0.356): -9.65,115.06 -9.65,-6.35 116.08,-6.35 116.08,115.06
LS0  (via drill 0.51)
  Top 0.254: v56.41,100.66 56.41,97.87 JP1.7
  Bottom 0.254: v56.41,100.66 58.15,98.92 C13.1
  Bottom 0.305: 56.11,91.1 LS0.E | R25.2 56.13,91.22 LS0.E | LS0.E 58.15,93.14 C13.1
LS1  (via drill 0.51)
  Top 0.254: v56.41,101.88 59.99,98.3 JP1.5
  Bottom 0.254: R27.2 59.03,92.43 59.03,95.33 58.61,95.75 58.61,99.68 v56.41,101.88
  Bottom 0.305: C14.1 64.61,91.69 63.52,90.6 63.45,90.68 LS1.E 60.79,90.68 R27.2
LS2  (via drill 0.51)
  Top 0.254: JP1.3 62.96,96.83 64.3,98.17 65.85,98.17 66.04,97.98 66.04,96.51 66.39,96.16 70.62,96.16 v72.62,94.16
  Bottom 0.254: v72.62,94.16 71.03,92.57 C15.1
  Bottom 0.305: R29.2 66.47,89.64 66.85,89.26 67.92,89.26 68.1,89.08 LS2.E 69.55,89.06 71.03,90.54 C15.1
LS3  (via drill 0.51)
  Top 0.254: JP1.1 66.37,95.53 69.91,95.53 75.93,89.51 v78.31,89.51
  Bottom 0.254: v78.31,89.51 77.84,89.51 C16.1 | LS3.E 73.12,86.5 R31.2
  Bottom 0.305: C16.1 74.83,86.5 LS3.E
LS4  (via drill 0.51)
  Top 0.254: U$1.1 98.8,57.17 100.35,58.71 100.35,61.57 v100.74,61.97 | v83.67,85.01 88.14,80.54 88.74,80.54 89.23,80.05 89.23,77.5 90.38,76.35 93.83,76.35 94.59,75.59 94.59,73.56 94.59,73.44 95.55,72.48 95.55,70.4 97.43,68.52 97.43,66.36 98.48,65.3 99.02,65.3 v99.41,64.92
  Bottom 0.254: v83.67,85.01 83.43,84.77 C1.1 | v100.74,61.97 100.74,62.68 99.93,63.49 99.93,64.4 v99.41,64.92
  Bottom 0.305: R1.2 77.47,84.13 LS4.E 80.4,82.99 C1.1
LS5  (via drill 0.51)
  Top 0.254: U$1.2 99.89,58.93 99.89,63.25 96.97,66.17 96.97,68.33 95.09,70.21 95.09,72.29 94.13,73.25 94.13,75.4 93.64,75.89 90.19,75.89 88.63,77.46 88.63,78.54 88.39,78.77 v88.39,79.7
  Bottom 0.254: C2.1 88.07,79.38 v88.39,79.7
  Bottom 0.305: R3.2 81.62,80.04 LS5.E 86.34,78.69 C2.1
LS6  (via drill 0.51)
  Top 0.254: U$1.3 98.1,57.88 99.43,59.21 99.43,63.06 96.52,65.98 96.52,68.14 94.63,70.03 94.63,71.91 94.63,72.1 93.49,73.24 93.49,73.56 93.49,74.86 v93.29,75.06
  Bottom 0.254: v93.29,75.06 92.86,74.62 91.85,74.62 91.09,73.86 C3.1
  Bottom 0.305: R5.2 85.37,74.82 LS6.E 87.22,72.97 89.25,72.97 C3.1
LS7  (via drill 0.51)
  Top 0.254: U$1.4 97.74,58.23 98.98,59.46 98.98,62.87 96.04,65.81 96.04,66.89 95.68,67.25 v95.68,67.79
  Bottom 0.254: v95.68,67.79 94.87,67.79 94.27,67.19 92.98,67.19 C4.1
  Bottom 0.305: R7.2 88.58,68.62 LS7.E 89.8,67.4 C4.1
LS8  (via drill 0.51)
  Top 0.254: U$1.48 96.17,57.86 v94.92,57.86
  Bottom 0.254: C5.1 94.28,59.99 94.59,59.68 94.59,58.19 v94.92,57.86
  Bottom 0.305: R9.2 90.6,63.79 LS8.E 91.97,60.91 C5.1
LS9  (via drill 0.51)
  Top 0.254: U$1.47 98.42,54.88 97.92,55.38 94.07,55.38 93.24,54.56 v93.24,53.95
  Bottom 0.254: 94.26,54.12 C6.1 94.45,53.95 v93.24,53.95
  Bottom 0.305: R11.2 91.15,56.21 LS9.E 91.12,54.98 93.04,53.06 93.56,53.06 C6.1
LS10  (via drill 0.51)
  Top 0.254: v96.27,46.56 96.27,48.31 97.6,49.65 97.6,52.07 98.71,53.17 98.71,53.88 98.1,54.5 U$1.46
  Bottom 0.254: C7.1 94.92,46.56 v96.27,46.56
  Bottom 0.305: R13.2 90.91,50.32 LS10.E 90.65,48.92 91.82,47.75 92.96,47.75 C7.1
LS11  (via drill 0.51)
  Top 0.254: U$1.45 97.74,54.14 98.25,53.63 98.25,53.36 97.15,52.26 97.15,49.84 94.63,47.33 94.63,40.52 95.07,40.08 v95.07,39.57
  Bottom 0.254: v95.07,39.57 93.65,39.57 C8.1
  Bottom 0.305: R15.2 89.73,44.89 LS11.E 89.06,43.3 90.97,41.39 C8.1
LS12  (via drill 0.51)
  Top 0.254: U$1.40 95.97,52.37 96.69,51.66 96.69,50.03 94.17,47.52 94.17,40.43 90.04,36.3 v90.04,34.01
  Bottom 0.254: C9.1 90.04,34.04 v90.04,34.01
  Bottom 0.305: R17.2 87.68,39.89 LS12.E 86.5,37.59 C9.1
LS13  (via drill 0.51)
  Top 0.254: v85.9,28.02 85.9,32.81 93.72,40.62 93.72,47.7 96.23,50.22 96.23,51.41 95.62,52.02 U$1.39
  Bottom 0.254: C10.1 84.54,29.38 v85.9,28.02
  Bottom 0.305: R19.2 84.29,35 LS13.E 82.97,31.56 C10.1
LS14  (via drill 0.51)
  Top 0.254: v80.62,23.42 80.62,28.17 93.26,40.81 93.26,47.9 95.78,50.41 95.78,51.19 U$1.38
  Bottom 0.254: C11.1 79.64,24.4 v80.62,23.42
  Bottom 0.305: R21.2 79.68,30.34 LS14.E 78.69,26.54 C11.1
LS15  (via drill 0.51)
  Top 0.254: v74.32,19.43 74.32,22.52 92.8,41 92.8,49.23 U$1.37
  Bottom 0.254: C12.1 74.32,21.6 v74.32,19.43
  Bottom 0.305: R23.2 74.56,26.72 LS15.E 72.97,25.13 72.97,22.78 73.83,21.93 C12.1
LS16  (via drill 0.51)
  Top 0.254: U$1.36 92.34,50.68 92.34,41.19 71.16,20 69.04,20 67.64,18.6 v67.64,17.73
  Bottom 0.254: v67.64,17.73 67.64,19.28 C17.1
  Bottom 0.305: R33.2 69.49,23.29 LS16.E 67.55,22.72 C17.1
LS17  (via drill 0.51)
  Top 0.254: U$1.35 91.89,50.93 91.89,41.38 70.97,20.46 65.31,20.46 v61.04,16.18
  Bottom 0.254: C18.1 60.91,16.31 v61.04,16.18
  Bottom 0.305: R35.2 62.33,21.64 LS17.E 60.91,20.38 C18.1
LS18  (via drill 0.51)
  Top 0.254: v53.75,15.95 58.71,20.91 70.78,20.91 91.43,41.57 91.43,45.47 91.43,51.18 U$1.34
  Bottom 0.254: C19.1 53.75,17.11 v53.75,15.95
  Bottom 0.305: R37.2 56.36,20.89 LS18.E 55.21,21.12 54.15,20.07 54.15,17.74 C19.1
LS19  (via drill 0.51)
  Top 0.254: U$1.33 90.97,51.43 90.97,41.76 70.59,21.37 52.32,21.37 52.03,21.37 50.35,21.37 v46.48,17.5
  Bottom 0.254: C20.1 46.59,17.5 v46.48,17.5
  Bottom 0.305: R39.2 51.48,21.72 LS19.E 48.56,21.72 47.8,20.96 C20.1
LS20  (via drill 0.51)
  Top 0.254: U$1.32 90.52,51.68 90.52,41.95 70.4,21.83 42.81,21.83 v40.08,19.1
  Bottom 0.254: C21.1 40.24,19.1 v40.08,19.1
  Bottom 0.305: R41.2 44.97,22.52 LS20.E 42.74,23.29 41.55,22.1 41.55,20.42 C21.1
LS21  (via drill 0.51)
  Top 0.254: v33.93,22.1 34.12,22.29 70.21,22.29 90.06,42.14 90.06,51.93 U$1.31
  Bottom 0.254: C22.1 33.94,22.1 v33.93,22.1
  Bottom 0.305: C22.1 35.46,24.66 36.62,25.82 LS21.E 39.6,25.82 R43.2
LS22  (via drill 0.51)
  Top 0.254: v36.75,27.05 38.02,27.05 42.33,22.74 70.02,22.74 89.6,42.33 89.6,52.18 U$1.30
  Bottom 0.254: R45.2 35.85,27.96 v36.75,27.05
  Bottom 0.305: C23.1 31.74,29.38 LS22.E 35.08,27.96 R45.2
LS23  (via drill 0.51)
  Top 0.254: v32.38,31.04 34.68,31.04 42.52,23.2 69.83,23.2 89.14,42.52 89.14,52.43 U$1.29
  Bottom 0.254: R47.2 31.53,31.89 v32.38,31.04
  Bottom 0.305: R47.2 30.47,32.56 LS23.E 28.62,34.42 26.39,34.42 C24.1
LS24  (via drill 0.51)
  Top 0.254: v28.63,35.92 30.45,35.92 42.7,23.66 69.64,23.66 88.69,42.7 88.69,52.68 U$1.28
  Bottom 0.254: R49.2 27.68,35.92 v28.63,35.92
  Bottom 0.305: R49.2 26.72,37.83 LS24.E 25.05,39.5 23.07,39.5 C25.1
LS25  (via drill 0.51)
  Top 0.254: v24.77,40.92 26.09,40.92 42.89,24.11 69.45,24.11 88.23,42.89 88.23,52.93 U$1.27
  Bottom 0.254: R51.2 24.77,41.63 v24.77,40.92
  Bottom 0.305: R51.2 23.29,43.11 LS25.E 22.77,44.72 C26.1
LS26  (via drill 0.51)
  Top 0.254: v23.14,46.38 24.57,44.95 24.57,43.08 43.08,24.57 69.26,24.57 87.77,43.08 87.77,53.18 U$1.26
  Bottom 0.254: R53.2 21.97,47.55 v23.14,46.38
  Bottom 0.305: R53.2 21.97,49.82 LS26.E 20.45,51.34 20.45,51.36 18.04,51.36 C27.1
LS27  (via drill 0.51)
  Top 0.254: v23.98,54.33 25.03,53.28 25.03,43.27 43.27,25.03 69.07,25.03 87.31,43.27 87.31,53.43 U$1.25
  Bottom 0.254: R55.2 23.95,54.36 v23.98,54.33
  Bottom 0.305: C28.1 17.79,57.81 20.78,57.81 21.17,57.42 LS27.E R55.2
LS28  (via drill 0.51)
  Top 0.254: v23.82,61.32 25.03,62.52 25.03,71.48 46.79,93.24 68.96,93.24 91.43,70.78 91.43,64.56 94.92,61.08 U$1.12
  Bottom 0.254: LS28.E 22.91,62.23 v23.82,61.32
  Bottom 0.305: R57.2 21.69,61.15 LS28.E 21.69,63.45 20.09,65.05 C29.1
LS29  (via drill 0.51)
  Top 0.254: v23.14,64.14 24.57,65.57 24.57,71.67 46.6,93.7 69.15,93.7 91.89,70.97 91.89,65.39 95.78,61.5 95.78,61.18 U$1.11
  Bottom 0.254: R59.2 23.14,66.02 v23.14,64.14
  Bottom 0.305: R59.2 23.31,67.08 LS29.E 23.31,69.73 21.88,71.16 C30.1
LS30  (via drill 0.51)
  Top 0.254: v26.24,76.2 28.45,76.2 38.78,86.52 46.41,94.16 69.34,94.16 92.34,71.16 92.34,65.58 96.23,61.69 96.23,60.96 95.62,60.35 U$1.10
  Bottom 0.254: C31.1 24.55,76.2 v26.24,76.2
  Bottom 0.305: C31.1 25.85,74.91 LS30.E 25.85,72.92 R61.2
LS31  (via drill 0.51)
  Top 0.254: v29.23,82.35 30.54,81.04 32.65,81.04 46.22,94.61 69.53,94.61 90.25,73.89 92.8,71.34 92.8,65.77 96.69,61.88 96.69,60.71 95.97,60 U$1.9
  Bottom 0.254: C32.1 29.19,82.39 v29.23,82.35
  Bottom 0.305: C32.1 29.38,80.71 LS31.E 29.38,78.5 R63.2
LS32  (via drill 0.51)
  Top 0.254: v33.88,87.78 38.74,87.78 46.03,95.07 68.35,95.07 69.72,95.07 93.26,71.53 93.26,65.96 97.15,62.07 97.15,60.46 96.33,59.64 U$1.8
  Bottom 0.254: C33.1 32.96,86.86 v33.88,87.78
  Bottom 0.305: R65.2 32.83,82.99 LS32.E 33.65,86.11 C33.1
LS33  (via drill 0.51)
  Top 0.254: U$1.7 96.68,59.29 97.6,60.21 97.6,62.26 94.1,65.77 v94.1,66.36
  Bottom 0.254: LS33.E 42.81,86.5 43.38,87.06 63.61,87.06 64.57,86.11 68.86,86.11 71.7,83.26 73.18,83.26 88.28,68.16 88.28,67.67 89.59,66.36 v94.1,66.36
  Bottom 0.305: R67.2 37.88,85.7 LS33.E 39.88,87.7 39.88,88.16 38.61,89.43 C34.1
LS34  (via drill 0.51)
  Top 0.254: U$1.6 97.04,58.94 98.06,59.96 98.06,62.45 95.12,65.39 95.12,66.52 93.72,67.92 93.72,71.72 92.2,73.24 v92.2,73.78
  Bottom 0.254: LS34.E 45.76,87.52 63.84,87.52 64.77,86.59 69.09,86.59 71.88,83.8 73.43,83.8 84.76,72.47 90.88,72.47 v92.2,73.78
  Bottom 0.305: R69.2 42.85,89.08 LS34.E 44.69,89.58 C35.1
LS35  (via drill 0.51)
  Top 0.254: U$1.5 97.39,58.58 98.52,59.71 98.52,62.64 95.58,65.58 95.58,66.7 94.17,68.11 94.17,71.91 93.36,72.73 93.03,73.05 93.03,74.13 92.54,74.62 90.82,74.62 87.79,77.65 v87.79,78.19
  Bottom 0.254: LS35.E 51.97,88.77 63.48,88.77 65.02,87.22 69.37,87.22 72.19,84.4 73.61,84.4 81.18,76.83 82.32,76.83 83.67,78.19 v87.79,78.19
  Bottom 0.305: R71.2 48.38,90.65 LS35.E 51.18,91.74 C36.1
MUX_OUT  (via drill 0.51)
  Top 0.254: v45.72,90.37 45.72,91.53 46.98,92.79 68.77,92.79 90.97,70.59 90.97,64.37 93.95,61.39 93.95,60.32 94.59,59.68 94.59,58.99 94.1,58.5 93.32,58.5 90.98,56.16 90.98,55.02 92.9,53.11 93.34,53.11 93.75,52.7 94.46,52.7 95.73,53.97 96.5,53.97 97.01,53.46 U$1.43 | v44.5,94.94 46.38,96.83 JP1.15
  Bottom 0.254: v45.72,90.37 45.72,92.75 45.73,92.78 45.72,92.82 45.72,93.73 v44.5,94.94
N$1
  Bottom 0.305: R4.1 62.51,97.41 63.27,96.64 D2.A
N$2
  Bottom 0.305: R2.1 55.91,96.91 D1.A
N$3
  Bottom 0.305: R6.1 68.94,96.62 69.55,96.01 69.55,94.97 70.1,94.41 D3.A
N$4
  Bottom 0.305: R8.1 75.38,93.1 76.55,91.93 D4.A
N$5
  Bottom 0.305: D5.A 82.37,89.39 R10.1
N$6
  Bottom 0.305: D6.A 87.34,84.95 R12.1
N$7
  Bottom 0.305: R14.1 91.82,76.85 D7.A
N$8
  Bottom 0.305: D8.A 95.13,70.77 R16.1
N$9
  Bottom 0.305: R18.1 97.02,64.42 97.02,64.25 96.29,63.52 D9.A
N$10
  Bottom 0.305: D10.A 98.36,57.63 98.56,57.84 R20.1
N$11
  Bottom 0.305: D11.A 96.56,49.07 R22.1
N$12
  Bottom 0.305: D12.A 95.24,42.21 R24.1
N$13
  Bottom 0.305: D13.A 92.43,35.82 R26.1
N$14
  Bottom 0.305: D14.A 88.21,30.8 R28.1
N$15
  Bottom 0.305: D15.A 84.83,24.98 R30.1
N$16
  Bottom 0.305: D16.A 76.83,20.57 R32.1
N$17
  Bottom 0.305: D17.A 70.45,17.55 71.86,17.55 R34.1
N$18
  Bottom 0.305: R36.1 64.79,14.96 63.73,16.03 D18.A
N$19
  Bottom 0.305: D19.A 56.62,15.43 R38.1
N$20
  Bottom 0.305: D20.A 50.78,14.42 R40.1
N$21
  Bottom 0.305: R42.1 42.9,16.36 42.9,17.2 D21.A
N$22
  Bottom 0.305: R44.1 36.45,19.29 36.45,20.34 35.89,20.9 D22.A
N$23
  Bottom 0.305: D23.A 30.4,24.58 30.4,23.14 R46.1
N$24
  Bottom 0.305: R48.1 25.28,29.7 D24.A
N$25
  Bottom 0.305: D25.A 20.9,33.68 R50.1
N$26
  Bottom 0.305: D26.A 17.89,41.46 17.26,40.83 R52.1
N$27
  Bottom 0.305: R54.1 14.99,47.42 16.03,48.46 D27.A
N$28
  Bottom 0.305: D28.A 13.76,54.53 R56.1
N$29
  Bottom 0.305: D29.A 14.29,61.46 R58.1
N$30
  Bottom 0.305: D30.A 17.58,70.11 16.37,68.9 R60.1
N$31
  Bottom 0.305: R62.1 19.02,75.58 19.96,76.52 D31.A
N$32
  Bottom 0.305: D32.A 23,82.39 R64.1
N$33
  Bottom 0.305: R66.1 D33.A
N$34
  Bottom 0.305: R68.1 34.42,91.95 35.03,91.34 35.61,91.34 D34.A
N$35
  Bottom 0.305: R70.1 40.65,95.24 41.39,94.5 D35.A
N$36
  Bottom 0.305: R72.1 47.27,97.51 48.49,96.29 D36.A
WR
  Top 0.254: JP1.14 53.05,87.77 69.26,87.77 87.77,69.26 87.77,60.6 U$1.21

### Text on the board
tPlace: 1 | James Wallington | Sam Tudor | fire / water / earth / air / hardware / software | James Yelland | Nakul Doshi | Lachlan Grant | LJ STAND | AUSTRALIA